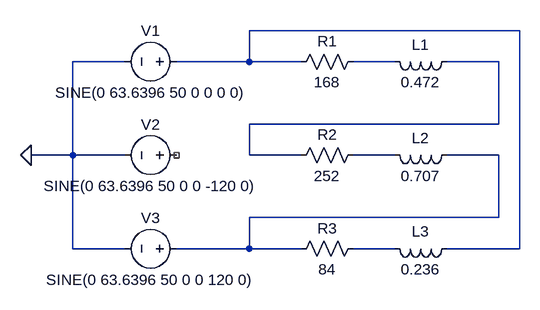
[diagram p0: schematic scheme6.asc]
scheme6.asc, the LTspice schematic file:
Version 4
SHEET 1 964 680
WIRE 960 -48 544 -48
WIRE 352 0 272 0
WIRE 544 0 544 -48
WIRE 544 0 432 0
WIRE 624 0 544 0
WIRE 768 0 704 0
WIRE 928 0 848 0
WIRE 928 96 928 0
WIRE 928 96 544 96
WIRE 272 144 272 0
WIRE 272 144 208 144
WIRE 352 144 272 144
WIRE 544 144 544 96
WIRE 624 144 544 144
WIRE 768 144 704 144
WIRE 928 144 848 144
WIRE 928 240 928 144
WIRE 928 240 544 240
WIRE 272 288 272 144
WIRE 352 288 272 288
WIRE 544 288 544 240
WIRE 544 288 432 288
WIRE 624 288 544 288
WIRE 768 288 704 288
WIRE 960 288 960 -48
WIRE 960 288 848 288
FLAG 208 144 0
SYMBOL voltage 448 0 R90
WINDOW 0 -32 56 VBottom 2
WINDOW 3 32 56 VTop 2
WINDOW 123 0 0 Left 0
WINDOW 39 0 0 Left 0
SYMATTR InstName V1
SYMATTR Value SINE(0 63.6396 50 0 0 0 0)
SYMBOL voltage 448 144 R90
WINDOW 0 -32 56 VBottom 2
WINDOW 3 32 56 VTop 2
WINDOW 123 0 0 Left 0
WINDOW 39 0 0 Left 0
SYMATTR InstName V2
SYMATTR Value SINE(0 63.6396 50 0 0 -120 0)
SYMBOL voltage 448 288 R90
WINDOW 0 -32 56 VBottom 2
WINDOW 3 32 56 VTop 2
WINDOW 123 0 0 Left 0
WINDOW 39 0 0 Left 0
SYMATTR InstName V3
SYMATTR Value SINE(0 63.6396 50 0 0 120 0)
SYMBOL res 720 -16 R90
WINDOW 0 0 56 VBottom 2
WINDOW 3 32 56 VTop 2
SYMATTR InstName R1
SYMATTR Value 168
SYMBOL ind 864 -16 R90
WINDOW 0 5 56 VBottom 2
WINDOW 3 32 56 VTop 2
SYMATTR InstName L1
SYMATTR Value 0.472
SYMBOL ind 864 128 R90
WINDOW 0 5 56 VBottom 2
WINDOW 3 32 56 VTop 2
SYMATTR InstName L2
SYMATTR Value 0.707
SYMBOL ind 864 272 R90
WINDOW 0 5 56 VBottom 2
WINDOW 3 32 56 VTop 2
SYMATTR InstName L3
SYMATTR Value 0.236
SYMBOL res 720 128 R90
WINDOW 0 0 56 VBottom 2
WINDOW 3 32 56 VTop 2
SYMATTR InstName R2
SYMATTR Value 252
SYMBOL res 720 272 R90
WINDOW 0 0 56 VBottom 2
WINDOW 3 32 56 VTop 2
SYMATTR InstName R3
SYMATTR Value 84

The netlist it stands for:
* scheme6.asc
V1 N001 0 SINE(0 63.6396 50 0 0 0 0)
V2 NC_01 0 SINE(0 63.6396 50 0 0 -120 0)
V3 N005 0 SINE(0 63.6396 50 0 0 120 0)
R1 N002 N001 168
L1 N003 N002 0.472
L2 N005 N004 0.707
L3 N001 N006 0.236
R2 N004 N003 252
R3 N006 N005 84
.backanno
.end